# Altium schematic sheet Sheet2.SchDoc
size 420 x 297 mm; SheetNumber: 1; SheetTotal: 1; GOST_Number: {Number}; GOST_DocumentNameLine1: {DocumentNameLine1}; GOST_Engineer: {Engineer}; GOST_Checker: {Checker}; GOST_TechControl: {TechControl}; GOST_NormControl: {NormControl}; GOST_Approver: {Approver}; GOST_Company: {Company}; GOST_DocumentNameLine2: {DocumentNameLine2}; GOST_DocumentNameLine3: {DocumentNameLine3}; GOST_DocumentNameLine4: {DocumentNameLine4}
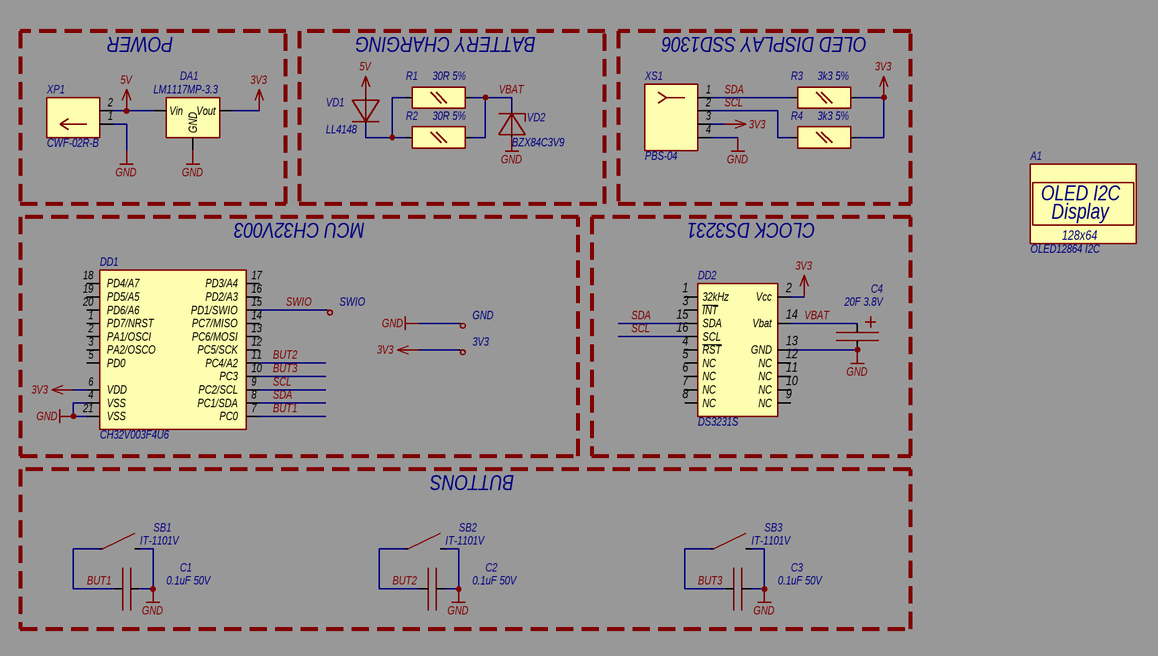
[diagram p0: Sheet2.SchDoc]

## Parts
A1  OLED12864 I2C  [OLED12864 I2C connector]
C1  0.1uF 50V  [CAP SMD0805]
C2  0.1uF 50V  [CAP SMD0805]
C3  0.1uF 50V  [CAP SMD0805]
C4  20F 3.8V  [LIC0813LAYDOWN]
DA1  LM1117MP-3.3  [SOT223]
DD1  CH32V003F4U6  [QFN20_3X3_0.4]
DD2  DS3231S  [SO16W]
R1  30R 5%  [SMD 0805]
R2  30R 5%  [SMD 0805]
R3  3k3 5%  [SMD 0805]
R4  3k3 5%  [SMD 0805]
SB1  IT-1101V  [IT-1101V_NO_SHIELD]
SB2  IT-1101V  [IT-1101V_NO_SHIELD]
SB3  IT-1101V  [IT-1101V_NO_SHIELD]
VD1  LL4148  [MINIMELF]
VD2  BZX84C3V9  [SOT23_1A3C]
XP1  CWF-02R-B  [CWF-02R-B]
XS1  PBS-04  [PBS-04]
XX1  SWIO  [SMD_Pad]  (no BOM)
XX2  GND  [SMD_Pad]  (no BOM)
XX3  3V3  [SMD_Pad]  (no BOM)

## Blocks framed on the sheet
POWER: DA1 XP1
BATTERY CHARGING: R1 R2 VD1 VD2
OLED DISPLAY SSD1306: R3 R4 XS1
MCU CH32V003: DD1 XX1-XX3
CLOCK DS3231: C4 DD2
BUTTONS: C1-C3 SB1-SB3

## Nets
3V3: DA1.2(Vout) DD1.6(VDD) DD2.2(Vcc) R3.2 R4.2 XS1.3 XX3.1(Name)
5V: DA1.3(Vin) VD1.A XP1.2
GND: C1.2 C2.2 C3.2 C4.2 DA1.1(GND) DD1.4(VSS) DD1.21(VSS) DD2.13(GND) SB1.2 SB2.2 SB3.2 VD2.A XP1.1 XS1.4 XX2.1(Name)
BUT1: C1.1 DD1.7(PC0) SB1.1
BUT2: C2.1 DD1.11(PC4/A2) SB2.1
BUT3: C3.1 DD1.10(PC3) SB3.1
SCL: DD1.9(PC2/SCL) DD2.16(SCL) R4.1 XS1.2
SDA: DD1.8(PC1/SDA) DD2.15(SDA) R3.1 XS1.1
SWIO: DD1.15(PD1/SWIO) XX1.1(Name)
VBAT: C4.1 DD2.14(Vbat) R1.2 R2.2 VD2.C
NetR1_1: R1.1 R2.1 VD1.C

Not connected (* = marked no-connect by the designer): DD1 1(PD7/NRST) 2(PA1/OSCI) 3(PA2/OSCO) 5(PD0) 12(PC5/SCK) 13(PC6/MOSI) 14(PC7/MISO) 16(PD2/A3) 17(PD3/A4) 18(PD4/A7) 19(PD5/A5) 20(PD6/A6); DD2 1(32kHz) 3(~{INT}) 4(~{RST}) 5(NC) 6(NC) 7(NC) 8(NC) 9(NC) 10(NC) 11(NC) 12(NC)

## Notes on the sheet
- Перв. примен.
- Справ. №
- Подп. и дата
- Инв. № дубл.
- Взам. инв. №
- Изм.
- Лист
- № докум.
- Подп.
- Дата
- Лит.
- Масса
- Масштаб
- Разраб.
- Пров.
- Т. контр.
- Листов
- Инв. № подл.
- Н. контр.
- Утв.
- Копировал
- Формат
- А3
- (in symbol OLED12864 I2C connector) OLED I2C; Display; 128x64

## Library data of the parts
A1 = OLED12864 I2C connector: Код: 2; Value: OLED12864 I2C; Part Number: OLED12864 I2C connector
C1-C3 = Cap 0805 0.1uF 50V: Конденсатор керамический SMD 0805 0.1uF 50V ±20%; Код: 42; Class: Конденсатор неполярный SMD; Value: 0.1uF 50V; Part Number: Cap 0805 0.1uF 50V
C4 = LIC 0813 206: Ионистор 20F 3.8V 0813; Код: 15; Value: 20F 3.8V; Part Number: LIC 0813 206; Class: Ионистор
DA1 = LM1117MP-3.3: LDO стабилизатор; Код: 137; Class: Микросхема; Value: LM1117MP-3.3; Part Number: LM1117MP-3.3
DD1 = CH32V003F4U6: Микроконтроллер CH32V003F4U6 QFN20 -40 +85; Код: 43; Part Number: CH32V003F4U6; Value: CH32V003F4U6; Class: Микроконтроллер; Temperature: -40 +85
DD2 = DS3231S: Микросхема DS3231S SO16W часы реального времени; Код: 7; Value: DS3231S; Part Number: DS3231S; Class: Микросхема; Поле9: часы реального времени
R1 R2 = Res 0805 30R 5%: Резистор SMD 0805 30R 5%; Код: 1192; Value: 30R 5%; Part Number: Res 0805 30R 5%; Class: Резистор SMD
R3 R4 = Res 0805 3k3 5%: Резистор SMD 0805 3k3 5%; Код: 1241; Value: 3k3 5%; Part Number: Res 0805 3k3 5%; Class: Резистор SMD
SB1-SB3 = IT-1101V_no_shield: Кнопка тактовая IT-1101V угловая без рамки; Код: 14; Value: IT-1101V_no_shield; Part Number: IT-1101V_no_shield; Class: Кнопка тактовая
VD1 = LL4148: Диод LL4148; Код: 12; Class: Диоды; Value: LL4148; Part Number: LL4148
VD2 = BZX84C3V9: Стабилитрон BZX84C3V9 SOT23; Код: 6; Class: Стабилитроны; Value: BZX84C3V9; Part Number: BZX84C3V9
XP1 = CWF-02R-B: Разъём CWF-02R-B вилка угловая 2,50мм тип B; Код: 346; Value: CWF-02R-B; Part Number: CWF-02R-B; Class: Разъём; Поле9: вилка угловая 2,50мм тип B
XS1 = PBS-04: Разъём PBS-04 гнездо однорядное 2,54мм; Код: 120; Value: PBS-04; Part Number: PBS-04; Class: Разъём; Поле9: гнездо однорядное 2,54мм
XX1-XX3 = SMD Pad: Value: SMD Pad; Код: 4; Class: Контактная площадка; Part Number: SMD Pad